# EasyEDA schematic sch.json
TITLE: Sheet_1; REV: 1.0; Date: 2024-04-18; Sheet: 1/1; Drawn By: h; Company: Your Company
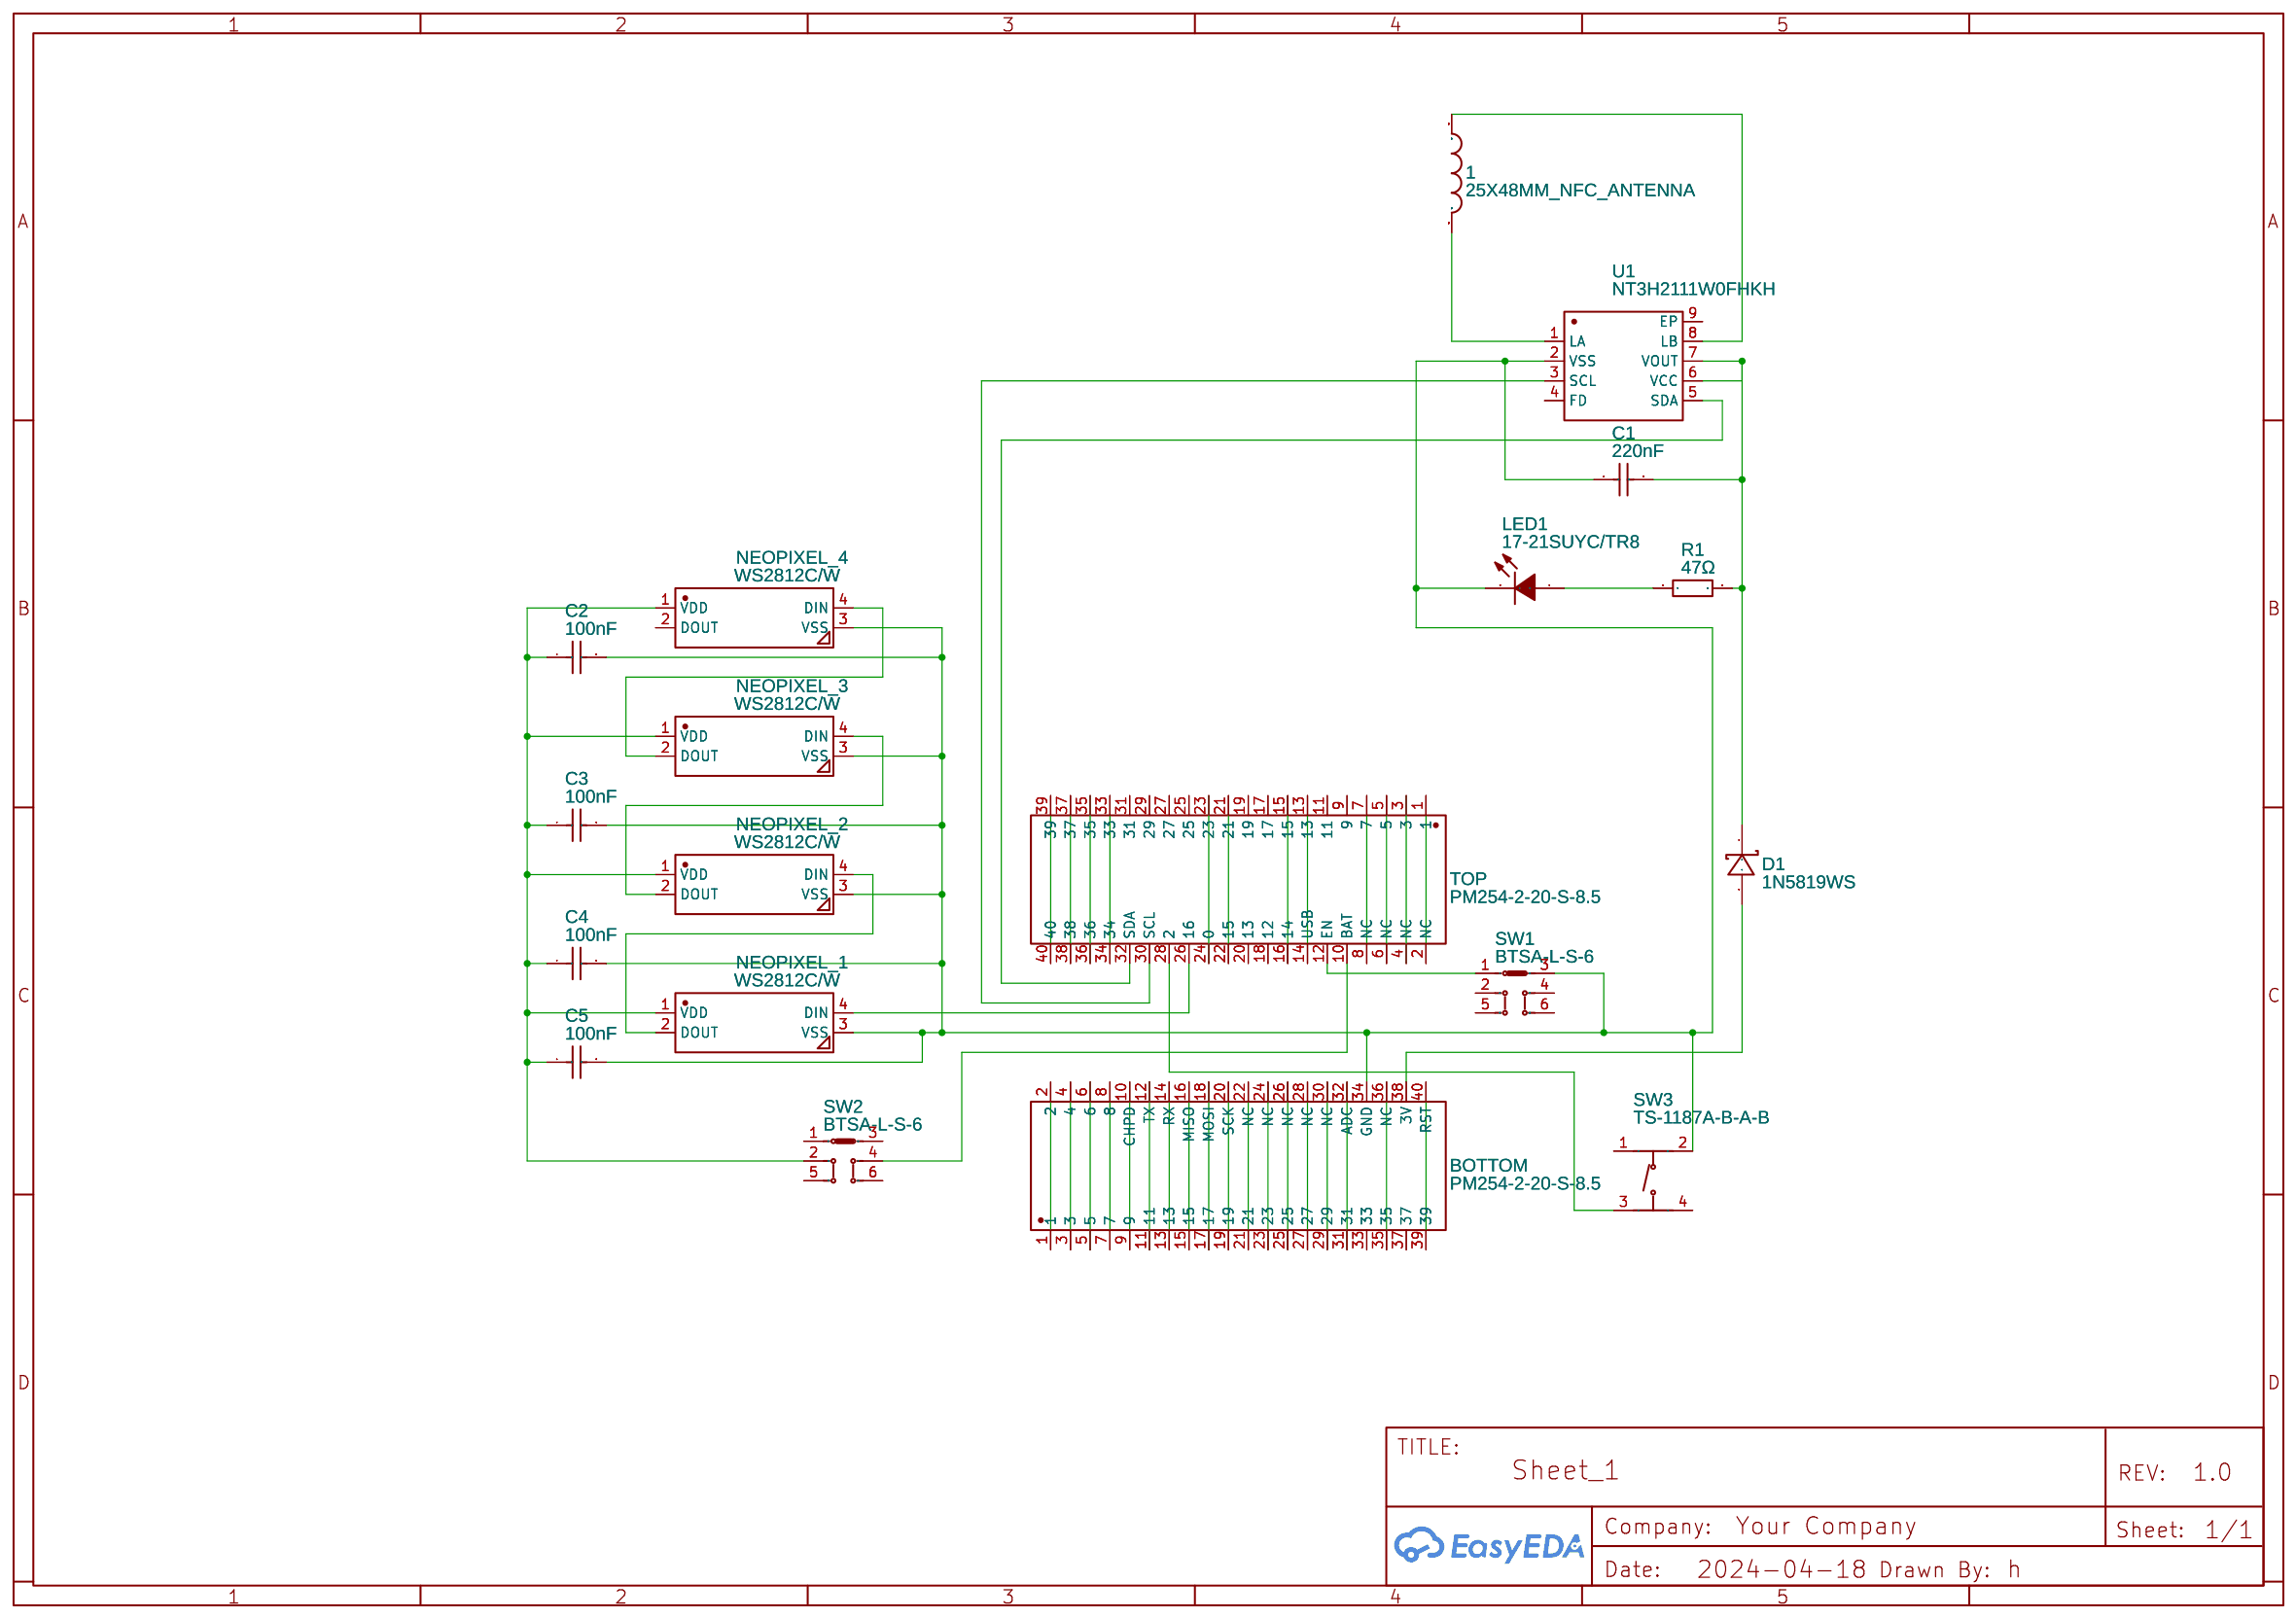
[diagram p0: schematic sheet]

## Parts
1  25X48MM_NFC_ANTENNA  [25X48MM_NFC_ANTENNA]
BOTTOM  PM254-2-20-S-8.5  [HDR-SMD_40P-P2.54-V-F-R2-C20-S2.54-LS7.1]
C1  220nF  [C0603]
C2  100nF  [C0402_NEW]
C3  100nF  [C0402_NEW]
C4  100nF  [C0402_NEW]
C5  100nF  [C0402_NEW]
D1  1N5819WS  [SOD-323_L1.8-W1.3-LS2.5-RD]
LED1  17-21SUYC/TR8  [LED0805-R-RD]
NEOPIXEL_1  WS2812C/W  [LED-SMD_4P-L5.0-W5.0-TL_WS2812B-B-NOSILK]
NEOPIXEL_2  WS2812C/W  [LED-SMD_4P-L5.0-W5.0-TL_WS2812B-B-NOSILK]
NEOPIXEL_3  WS2812C/W  [LED-SMD_4P-L5.0-W5.0-TL_WS2812B-B-NOSILK]
NEOPIXEL_4  WS2812C/W  [LED-SMD_4P-L5.0-W5.0-TL_WS2812B-B-NOSILK]
R1  47Ω  [R0603]
SW1  BTSA-L-S-6  [SW-SMD_BTSA-X-S-6]
SW2  BTSA-L-S-6  [SW-SMD_BTSA-X-S-6]
SW3  TS-1187A-B-A-B  [SW-SMD_4P-L5.1-W5.1-P3.70-LS6.5-TL-2]
TOP  PM254-2-20-S-8.5  [HDR-SMD_40P-P2.54-V-F-R2-C20-S2.54-LS7.1]
U1  NT3H2111W0FHKH  [XQFN-8_L1.6-W1.6-P0.50-BL]

## Library data of the parts
1 = 25X48MM_NFC_ANTENNA: Contributor: dnonoo
BOTTOM TOP = PM254-2-20-S-8.5: Supplier: LCSC; Supplier Part: C3975165; Manufacturer: HCTL(华灿天禄); Contributor: retropixels; JLCPCB Part Class: Extended Part
C1 = CL10B224KA8NNNC: Supplier: LCSC; Manufacturer: SAMSUNG(三星); Supplier Part: C21120; JLCPCB Part Class: Basic Part
C2-C5 = CL05B104KO5NNNC COPY: Supplier: LCSC; Manufacturer Part: CL05B104KO5NNNC; Manufacturer: SAMSUNG; Supplier Part: C1525; JLCPCB Part Class: Basic Part
D1 = 1N5819WS: Contributor: qarnet; Supplier: LCSC; Supplier Part: C191023; Manufacturer: Hottech(合科泰); JLCPCB Part Class: Basic Part
LED1 = 17-21SUYC/TR8: Supplier: LCSC; Manufacturer: KENTO; Manufacturer Part: KT-0805黄灯; Supplier Part: C2296; JLCPCB Part Class: Basic Part
NEOPIXEL_1-NEOPIXEL_4 = WS2812C/W: Supplier: LCSC; Supplier Part: C2761796; Manufacturer: worldsemi; Contributor: Ken Csaby; JLCPCB Part Class: Extended Part
R1 = 0603WAF470JT5E: Supplier: LCSC; Manufacturer: UNI-ROYAL(厚声); Supplier Part: C23182; JLCPCB Part Class: Basic Part
SW1 SW2 = BTSA-L-S-6: Contributor: LCSC; Supplier: LCSC; Supplier Part: C2693630; Manufacturer: ROCPU Switches(台普); JLCPCB Part Class: Extended Part
SW3 = TS-1187A-B-A-B: Contributor: LCSC; Supplier: LCSC; Supplier Part: C318884; Manufacturer: XKB Connectivity(中国星坤); JLCPCB Part Class: Basic Part
U1 = NT3H2111W0FHKH: Contributor: LCSC; Supplier: LCSC; Supplier Part: C710403; Manufacturer: NXP(恩智浦); JLCPCB Part Class: Extended Part

## Nets
Net-(1-P$1): 1.P$1 U1.8(LB)
Net-(1-P$2): 1.P$2 U1.1(LA)
Net-(BOTTOM-1): BOTTOM.1 BOTTOM.2
Net-(BOTTOM-3): BOTTOM.3 BOTTOM.4
Net-(BOTTOM-5): BOTTOM.5 BOTTOM.6
Net-(BOTTOM-7): BOTTOM.7 BOTTOM.8
Net-(BOTTOM-9): BOTTOM.9 BOTTOM.10(CHPD)
Net-(BOTTOM-11): BOTTOM.11 BOTTOM.12(TX)
Net-(BOTTOM-13): BOTTOM.13 BOTTOM.14(RX)
Net-(BOTTOM-15): BOTTOM.15 BOTTOM.16(MISO)
Net-(BOTTOM-17): BOTTOM.17 BOTTOM.18(MOSI)
Net-(BOTTOM-19): BOTTOM.19 BOTTOM.20(SCK)
Net-(BOTTOM-21): BOTTOM.21 BOTTOM.22(NC)
Net-(BOTTOM-23): BOTTOM.23 BOTTOM.24(NC)
Net-(BOTTOM-25): BOTTOM.25 BOTTOM.26(NC)
Net-(BOTTOM-27): BOTTOM.27 BOTTOM.28(NC)
Net-(BOTTOM-29): BOTTOM.29 BOTTOM.30(NC)
Net-(BOTTOM-31): BOTTOM.31 BOTTOM.32(ADC)
Net-(BOTTOM-34): BOTTOM.34(GND) C1.1 C2.2 C3.2 C4.2 C5.2 LED1.2(-) NEOPIXEL_1.3(VSS) NEOPIXEL_2.3(VSS) NEOPIXEL_3.3(VSS) NEOPIXEL_4.3(VSS) SW1.3 SW3.2(B) U1.2(VSS)
Net-(BOTTOM-35): BOTTOM.35 BOTTOM.36(NC)
Net-(BOTTOM-38): BOTTOM.38(3V) D1.2(A)
Net-(BOTTOM-39): BOTTOM.39 BOTTOM.40(RST)
Net-(C1-2): C1.2 D1.1(K) R1.2 U1.6(VCC) U1.7(VOUT)
Net-(C2-1): C2.1 C3.1 C4.1 C5.1 NEOPIXEL_1.1(VDD) NEOPIXEL_2.1(VDD) NEOPIXEL_3.1(VDD) NEOPIXEL_4.1(VDD) SW2.2
Net-(LED1-1): LED1.1(+) R1.1
Net-(NEOPIXEL_1-2): NEOPIXEL_1.2(DOUT) NEOPIXEL_2.4(DIN)
Net-(NEOPIXEL_1-4): NEOPIXEL_1.4(DIN) TOP.26(16)
Net-(NEOPIXEL_2-2): NEOPIXEL_2.2(DOUT) NEOPIXEL_3.4(DIN)
Net-(NEOPIXEL_3-2): NEOPIXEL_3.2(DOUT) NEOPIXEL_4.4(DIN)
Net-(SW1-1): SW1.1 TOP.12(EN)
Net-(SW2-4): SW2.4 TOP.10(BAT)
Net-(SW3-3): SW3.3(C) TOP.28(2)
Net-(TOP-1): TOP.1 TOP.2(NC)
Net-(TOP-3): TOP.3 TOP.4(NC)
Net-(TOP-5): TOP.5 TOP.6(NC)
Net-(TOP-7): TOP.7 TOP.8(NC)
Net-(TOP-13): TOP.13 TOP.14(USB)
Net-(TOP-15): TOP.15 TOP.16(14)
Net-(TOP-21): TOP.21 TOP.22(15)
Net-(TOP-23): TOP.23 TOP.24(0)
Net-(TOP-30): TOP.30(SCL) U1.3(SCL)
Net-(TOP-32): TOP.32(SDA) U1.5(SDA)
Net-(TOP-33): TOP.33 TOP.34
Net-(TOP-35): TOP.35 TOP.36
Net-(TOP-37): TOP.37 TOP.38
Net-(TOP-39): TOP.39 TOP.40

Not connected (* = marked no-connect by the designer): BOTTOM 33 37; NEOPIXEL_4 2(DOUT); SW1 2 4 5 6; SW2 1 3 5 6; SW3 1(A) 4(D); TOP 9 11 17 18(12) 19 20(13) 25 27 29 31; U1 4(FD) 9(EP)
